# Altium project charger.PrjPcb
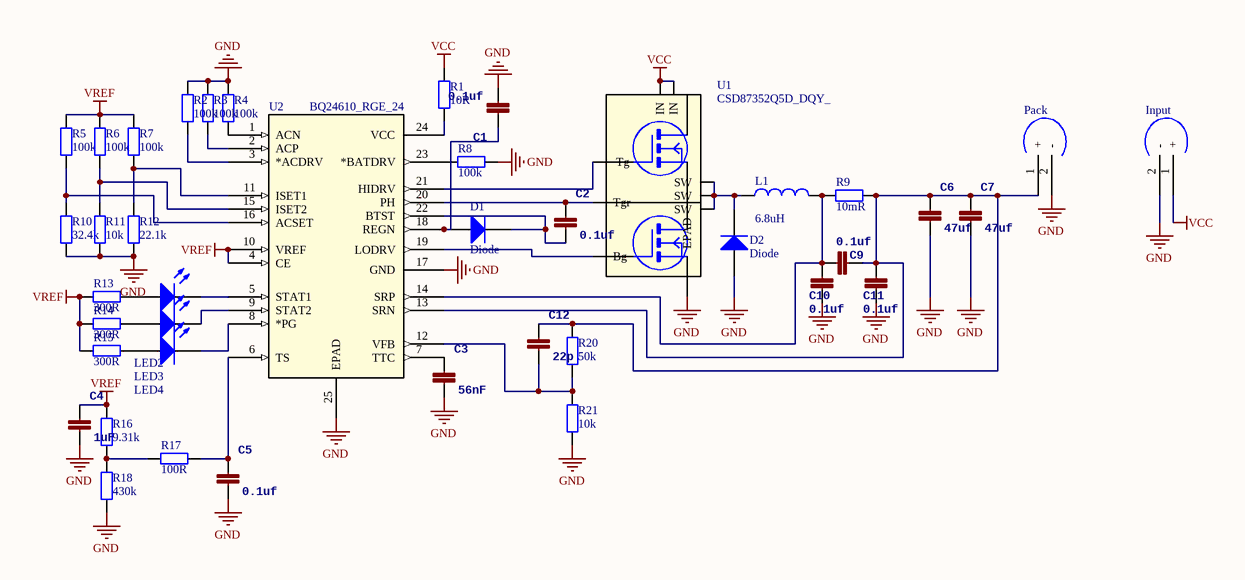
[diagram p0: charger.SchDoc]
1 sheet, 41 parts. Net scope: global (net labels, ports and power ports of the same name join across sheets).
Board file: charger.PcbDoc

## Sheet charger.SchDoc
size A4

### Parts
C1  0.1uf  [0603]
C2  0.1uf  [0603]
C3  56nF  [0603]
C4  1uF  [0603]
C5  0.1uf  [0603]
C6  47uf  [1210]
C7  47uf  [1210]
C9  0.1uf  [0603]
C10  0.1uf  [0603]
C11  0.1uf  [0603]
C12  22p  [0603]
D1  Diode  [0805]
D2  Diode  [SMC]
Input  Battery_AWG12  [Battery_AWG12]  (value not drawn)
L1  value 6.8uH  [GDRH127]  (hidden comment: Inductor)
LED2  LED0  [0603]  (value not drawn)
LED3  LED0  [0603]  (value not drawn)
LED4  LED0  [0603]  (value not drawn)
Pack  Battery_AWG12  [Battery_AWG12]  (value not drawn)
R1  10R  [0603]
R2  100k  [0603]
R3  100k  [0603]
R4  100k  [0603]
R5  100k  [0603]
R6  100k  [0603]
R7  100k  [0603]
R8  100k  [0603]
R9  10mR  [2512]
R10  32.4k  [0603]
R11  10k  [0603]
R12  22.1k  [0603]
R13  300R  [0603]
R14  300R  [0603]
R15  300R  [0603]
R16  9.31k  [0603]
R17  100R  [0603]
R18  430k  [0603]
R20  50k  [0603]
R21  10k  [0603]
U1  CSD87352Q5D_DQY_  [CSD87352Q5D]
U2  BQ24610_RGE_24  [BQ24610]

### Nets
GND: C1.1 C3.1 C4.1 C5.1 C6.1 C7.1 C10.2 C11.1 D2.1(A) Input.2(-) Pack.2(-) R2.1 R3.1 R4.2 R8.2 R10.2 R11.2 R12.2 R18.1 R21.2 U1.9(EPAD) U2.17(GND) U2.25(EPAD)
VCC: Input.1(+) R1.1 U1.1(IN) U1.2(IN)
VREF: C4.2 R5.1 R6.1 R7.1 R13.1 R14.1 R15.1 R16.2 U2.4(CE) U2.10(VREF)
NetC1_2: C1.2 D1.1(A) U2.18(REGN)
NetC2_1: C2.1 D1.2(K) U2.22(BTST)
NetC2_2: C2.2 U1.4(Tgr) U2.20(PH)
NetC3_2: C3.2 U2.7(TTC)
NetC5_2: C5.2 R17.2 U2.6(TS)
NetC6_2: C6.2 C7.2 C9.1 C11.2 C12.2 Pack.1(+) R9.2 R20.1 U2.13(SRN)
NetC9_2: C9.2 C10.1 L1.2 R9.1 U2.14(SRP)
NetC12_1: C12.1 R20.2 R21.1 U2.12(VFB)
NetD2_2: D2.2(K) L1.1 U1.6(SW) U1.7(SW) U1.8(SW)
NetLED2_1: LED2.1(A) R13.2
NetLED2_2: LED2.2(K) U2.5(STAT1)
NetLED3_1: LED3.1(A) R14.2
NetLED3_2: LED3.2(K) U2.9(STAT2)
NetLED4_1: LED4.1(A) R15.2
NetLED4_2: LED4.2(K) U2.8(*PG)
NetR1_2: R1.2 U2.24(VCC)
NetR2_2: R2.2 U2.3(*ACDRV)
NetR3_2: R3.2 U2.2(ACP)
NetR4_1: R4.1 U2.1(ACN)
NetR5_2: R5.2 R10.1 U2.16(ACSET)
NetR6_2: R6.2 R11.1 U2.15(ISET2)
NetR7_2: R7.2 R12.1 U2.11(ISET1)
NetR8_1: R8.1 U2.23(*BATDRV)
NetR16_1: R16.1 R17.1 R18.2
NetU1_3: U1.3(Tg) U2.21(HIDRV)
NetU1_5: U1.5(Bg) U2.19(LODRV)

### Library data of the parts
C1-C7 C9-C12 = CAP0402-CAP: 电容; PARTNO: CC0402ZRY5V7BB104
D1 = Diode: Default Diode; Published: 8-Jun-2000; LatestRevisionDate: 17-Jul-2002; LatestRevisionNote: Re-released for DXP Platform.; PackageVersion: Sep-1996; PackageReference: SMC; Publisher: Altium Limited; PackageDescription: DO-214-AB/SMC; 2 C-Bend Leads; Body 7.9 x 5.9 mm, inc. leads (LxW); Code_JEDEC: DO-214-AB
D2 = Diode: Default Diode; pin to pad: 1>2 2>1; Published: 8-Jun-2000; LatestRevisionDate: 17-Jul-2002; LatestRevisionNote: Re-released for DXP Platform.; PackageVersion: Sep-1996; PackageReference: SMC; Publisher: Altium Limited; PackageDescription: DO-214-AB/SMC; 2 C-Bend Leads; Body 7.9 x 5.9 mm, inc. leads (LxW); Code_JEDEC: DO-214-AB
L1 = Inductor: Code_IEC: 1005; Published: 8-Jun-2000; LatestRevisionDate: 29-May-2009; LatestRevisionNote: IPC-7351 Footprint Added.; PackageReference: 0402-A; Publisher: Altium Limited; PackageDescription: Chip Inductor; Code_JEITA: 0402
LED2-LED4 = LED0: Typical INFRARED GaAs LED; Published: 8-Jun-2000; LatestRevisionDate: 08-Jul-2005; LatestRevisionNote: Mech Layer 1 removed.; PackageReference: LED-0; Publisher: Altium Limited; PackageDescription: LED; 2 Leads
R1-R18 R20 R21 = Res2: 电阻; Value: 0Ohm; Published: 8-Jun-2000; LatestRevisionDate: 17-Jul-2002; LatestRevisionNote: Re-released for DXP Platform.; PackageReference: AXIAL-0.4; Publisher: Altium Limited; PackageDescription: Axial Device, Thru-Hole; 2 Leads; 0.4 in Pin Spacing
U1 = CSD87352Q5D_DQY_: Imported; Manufacturer: Texas Instruments; INDUSTRY_STD_PKG_TYPE: SON; FAMILY_NAME: POWER MOSFET MODULES; PIN_COUNT: 8; PACKAGE_DESIGNATOR: DQY; Datasheet URL: http://www.ti.com/lit/gpn/CSD87352Q5D; GENERIC_PART_NUMBER: CSD87352Q5D; RefDes: RefDes; Type: DEV; Value: Value
U2 = BQ24610_RGE_24: Imported; Manufacturer: Texas Instruments; INDUSTRY_STD_PKG_TYPE: VQFN; FAMILY_NAME: BATTERY CHARGE MANAGEMENT; PIN_COUNT: 24; PACKAGE_DESIGNATOR: RGE; Datasheet URL: http://www.ti.com/lit/gpn/BQ24610; GENERIC_PART_NUMBER: BQ24610; RefDes: RefDes; Type: DEV; Value: Value